# Altium schematic sheet mppt_interface_ch1.SchDoc: MPPT Interface CH1
size A3; Date: 2015-10-14; Author: Piotr Kuligowski; Revision: 1-0; SheetNumber: 8; SheetTotal: 8; Model: EM1
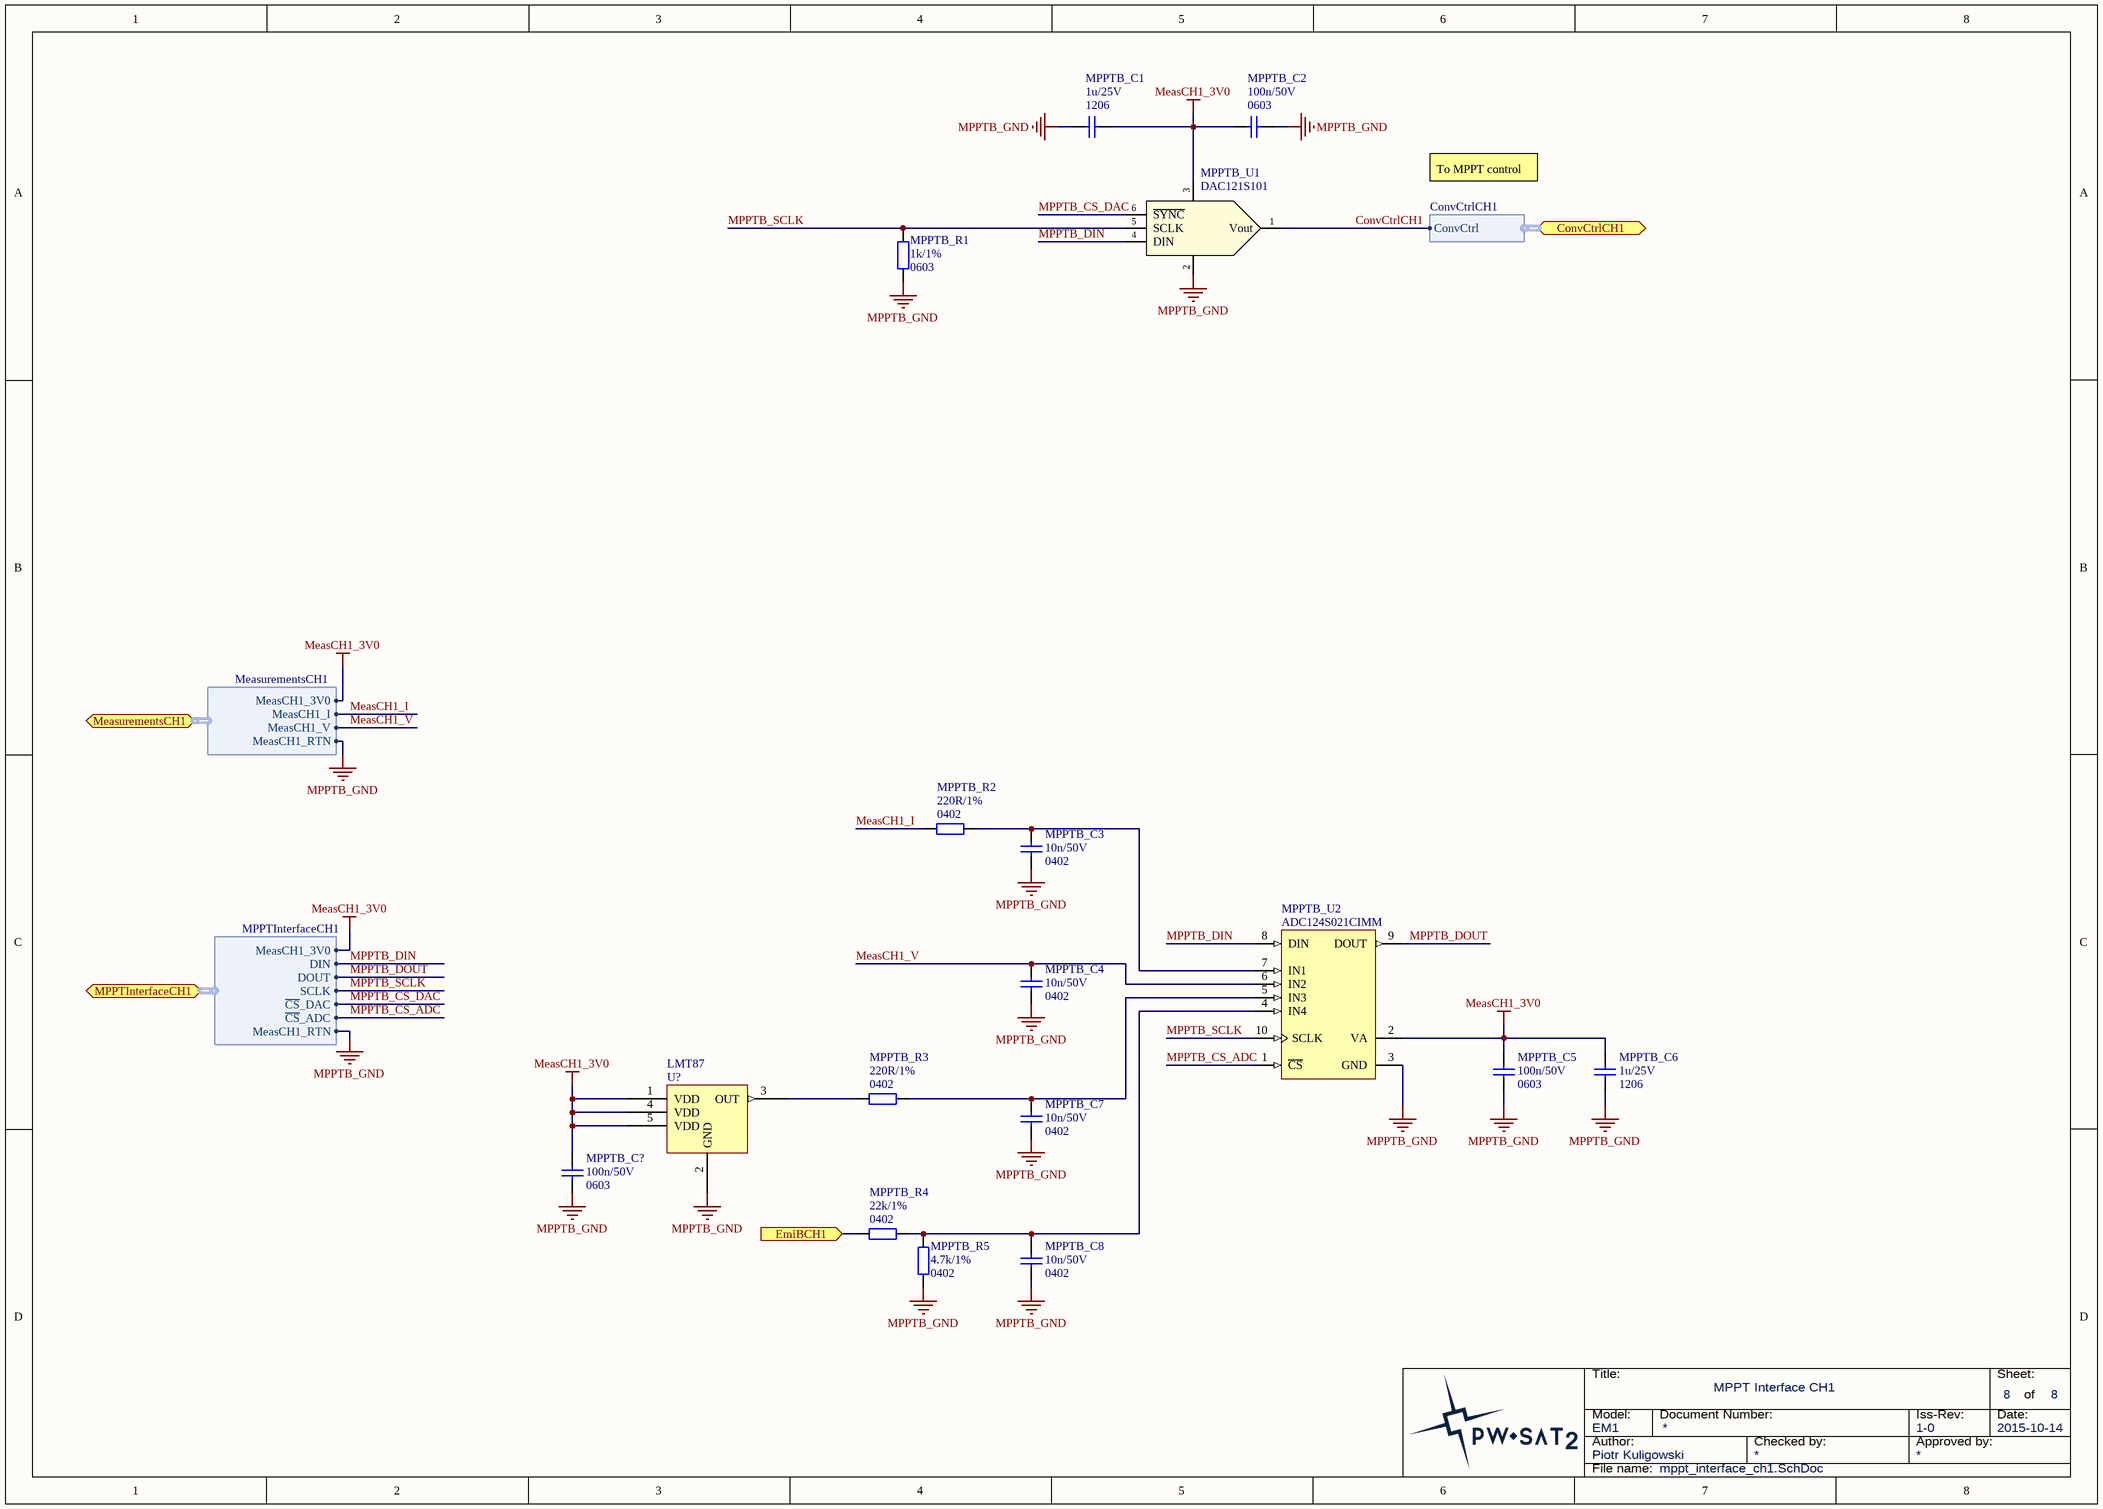
[diagram p0: mppt_interface_ch1.SchDoc]

## Parts
MPPTB_C1  Package: 1206  [SMD_Capacitor_1206]  (hidden comment: 1u/25V)
MPPTB_C2  Package: 0603  [SMD_Capacitor_0603]  (hidden comment: 100n/50V)
MPPTB_C3  Package: 0402  [SMD_Capacitor_0402]  (hidden comment: 10n/50V)
MPPTB_C4  Package: 0402  [SMD_Capacitor_0402]  (hidden comment: 10n/50V)
MPPTB_C5  Package: 0603  [SMD_Capacitor_0603]  (hidden comment: 100n/50V)
MPPTB_C6  Package: 1206  [SMD_Capacitor_1206]  (hidden comment: 1u/25V)
MPPTB_C7  Package: 0402  [SMD_Capacitor_0402]  (hidden comment: 10n/50V)
MPPTB_C8  Package: 0402  [SMD_Capacitor_0402]  (hidden comment: 10n/50V)
MPPTB_C?  Package: 0603  [SMD_Capacitor_0603]  (hidden comment: 100n/50V)
MPPTB_R1  Package: 0603  [SMD_Resistor_0603]  (hidden comment: 1k/1%)
MPPTB_R2  Package: 0402  [SMD_Resistor_0402]  (hidden comment: 220R/1%)
MPPTB_R3  Package: 0402  [SMD_Resistor_0402]  (hidden comment: 220R/1%)
MPPTB_R4  Package: 0402  [SMD_Resistor_0402]  (hidden comment: 22k/1%)
MPPTB_R5  Package: 0402  [SMD_Resistor_0402]  (hidden comment: 4.7k/1%)
MPPTB_U1  DAC121S101  [SOT23-6]
MPPTB_U2  ADC124S021CIMM  [MUB10A_L]
U?  LMT87  [SC70-LT5_N]

## Ports
ConvCtrlCH1 (harness ConvCtrlCH1), EmiBCH1 (in), MeasurementsCH1 (harness MeasurementsCH1), MPPTInterfaceCH1 (harness MPPTInterfaceCH1)

## Harnesses
MeasurementsCH1: MeasCH1_RTN, MeasCH1_V, MeasCH1_I, MeasCH1_3V0
ConvCtrlCH1: ConvCtrl
MPPTInterfaceCH1: DIN, DOUT, SCLK, ~{CS}_DAC, ~{CS}_ADC, MeasCH1_3V0, MeasCH1_RTN

## Nets
MeasCH1_3V0: MPPTB_C1.2 MPPTB_C2.2 MPPTB_C5.1 MPPTB_C6.1 MPPTB_C?.1 MPPTB_U1.3(Va) MPPTB_U2.2(VA) U?.1(VDD) U?.4(VDD) U?.5(VDD) ; port MeasurementsCH1.MeasCH1_3V0, port MPPTInterfaceCH1.MeasCH1_3V0
MPPTB_GND: MPPTB_C1.1 MPPTB_C2.1 MPPTB_C3.2 MPPTB_C4.2 MPPTB_C5.2 MPPTB_C6.2 MPPTB_C7.2 MPPTB_C8.2 MPPTB_C?.2 MPPTB_R1.2 MPPTB_R5.2 MPPTB_U1.2(GND) MPPTB_U2.3(GND) U?.2(GND) ; port MeasurementsCH1.MeasCH1_RTN, port MPPTInterfaceCH1.MeasCH1_RTN
ConvCtrlCH1: MPPTB_U1.1(Vout) ; port ConvCtrlCH1.ConvCtrl
EmiBCH1: MPPTB_R4.1 ; port EmiBCH1
MeasCH1_I: MPPTB_R2.1 ; port MeasurementsCH1.MeasCH1_I
MeasCH1_V: MPPTB_C4.1 MPPTB_U2.6(IN2) ; port MeasurementsCH1.MeasCH1_V
MPPTB_CS_ADC: MPPTB_U2.1(~{CS}) ; port MPPTInterfaceCH1.~{CS}_ADC
MPPTB_CS_DAC: MPPTB_U1.6(~{SYNC}) ; port MPPTInterfaceCH1.~{CS}_DAC
MPPTB_DIN: MPPTB_U1.4(DIN) MPPTB_U2.8(DIN) ; port MPPTInterfaceCH1.DIN
MPPTB_DOUT: MPPTB_U2.9(DOUT) ; port MPPTInterfaceCH1.DOUT
MPPTB_SCLK: MPPTB_R1.1 MPPTB_U1.5(SCLK) MPPTB_U2.10(SCLK) ; port MPPTInterfaceCH1.SCLK
NetMPPTB_C3_1: MPPTB_C3.1 MPPTB_R2.2 MPPTB_U2.7(IN1)
NetMPPTB_C7_1: MPPTB_C7.1 MPPTB_R3.2 MPPTB_U2.5(IN3)
NetMPPTB_C8_1: MPPTB_C8.1 MPPTB_R4.2 MPPTB_R5.1 MPPTB_U2.4(IN4)
NetMPPTB_R3_1: MPPTB_R3.1 U?.3(OUT)

## Notes on the sheet
- To MPPT control
- Title:
- Sheet:
- of
- Author:
- Model:
- Document Number:
- Checked by:
- Iss-Rev:
- Approved by:
- Date:
- File name:

## Library data of the parts
MPPTB_C1 MPPTB_C6 = Cer_C1206T105K3RALTU: Ceramic Cap Kemet COTS 1u/25V X7R 1206; ManufacturerPartNumber: C1206T105K3RALTU; Manufacturer: Kemet; Value: 1u/25V
MPPTB_C2 MPPTB_C5 MPPTB_C? = Cer_C0603T104K5RALTU: Ceramic Cap Kemet COTS 100n/50V X7R 0603; Manufacturer: Kemet; ManufacturerPartNumber: C0603T104K5RALTU; Value: 100n/50V
MPPTB_C3 MPPTB_C4 MPPTB_C7 MPPTB_C8 = Cer_C0402T103K5RALTU: Ceramic Cap Kemet COTS 10n/50V X7R 0402; ManufacturerPartNumber: C0402T103K5RALTU; Manufacturer: Kemet; Value: 10n/50V
MPPTB_R1 = CRCW06031K00FKxxxx: 1k/1% Vishay CRCW 0603 Resistor. 100mW, 100ppm, 75V.; Manufacturer: Vishay; ManufacturerPartNumber: CRCW06031K00FKxxxx; Value: 1k/1%
MPPTB_R2 MPPTB_R3 = CRCW0402220RFKxxxx: 220R/1% Vishay CRCW 0402 Resistor. 63mW, 100ppm, 50V.; Manufacturer: Vishay; ManufacturerPartNumber: CRCW0402220RFKxxxx; Value: 220R/1%
MPPTB_R4 = CRCW040222K0FKxxxx: 22k/1% Vishay CRCW 0402 Resistor. 63mW, 100ppm, 50V.; Manufacturer: Vishay; ManufacturerPartNumber: CRCW040222K0FKxxxx; Value: 22k/1%
MPPTB_R5 = CRCW04024K70FKxxxx: 4.7k/1% Vishay CRCW 0402 Resistor. 63mW, 100ppm, 50V.; ManufacturerPartNumber: CRCW04024K70FKxxxx; Manufacturer: Vishay; Value: 4.7k/1%
MPPTB_U1 = DAC121S101: 12-Bit Micro Power, RRO Digital-to-Analog Converter.; Manufacturer: Texas Instruments; Value: DAC121S101
MPPTB_U2 = ADC124S021CIMM/NOPB: Manufacturer: Texas Instruments; ManufacturerPartNumber: ADC124S021CIMM/NOPB; Value: ADC124S021CIMM
U? = LMT87: Analog Temperature Sensors with Class-AB Output